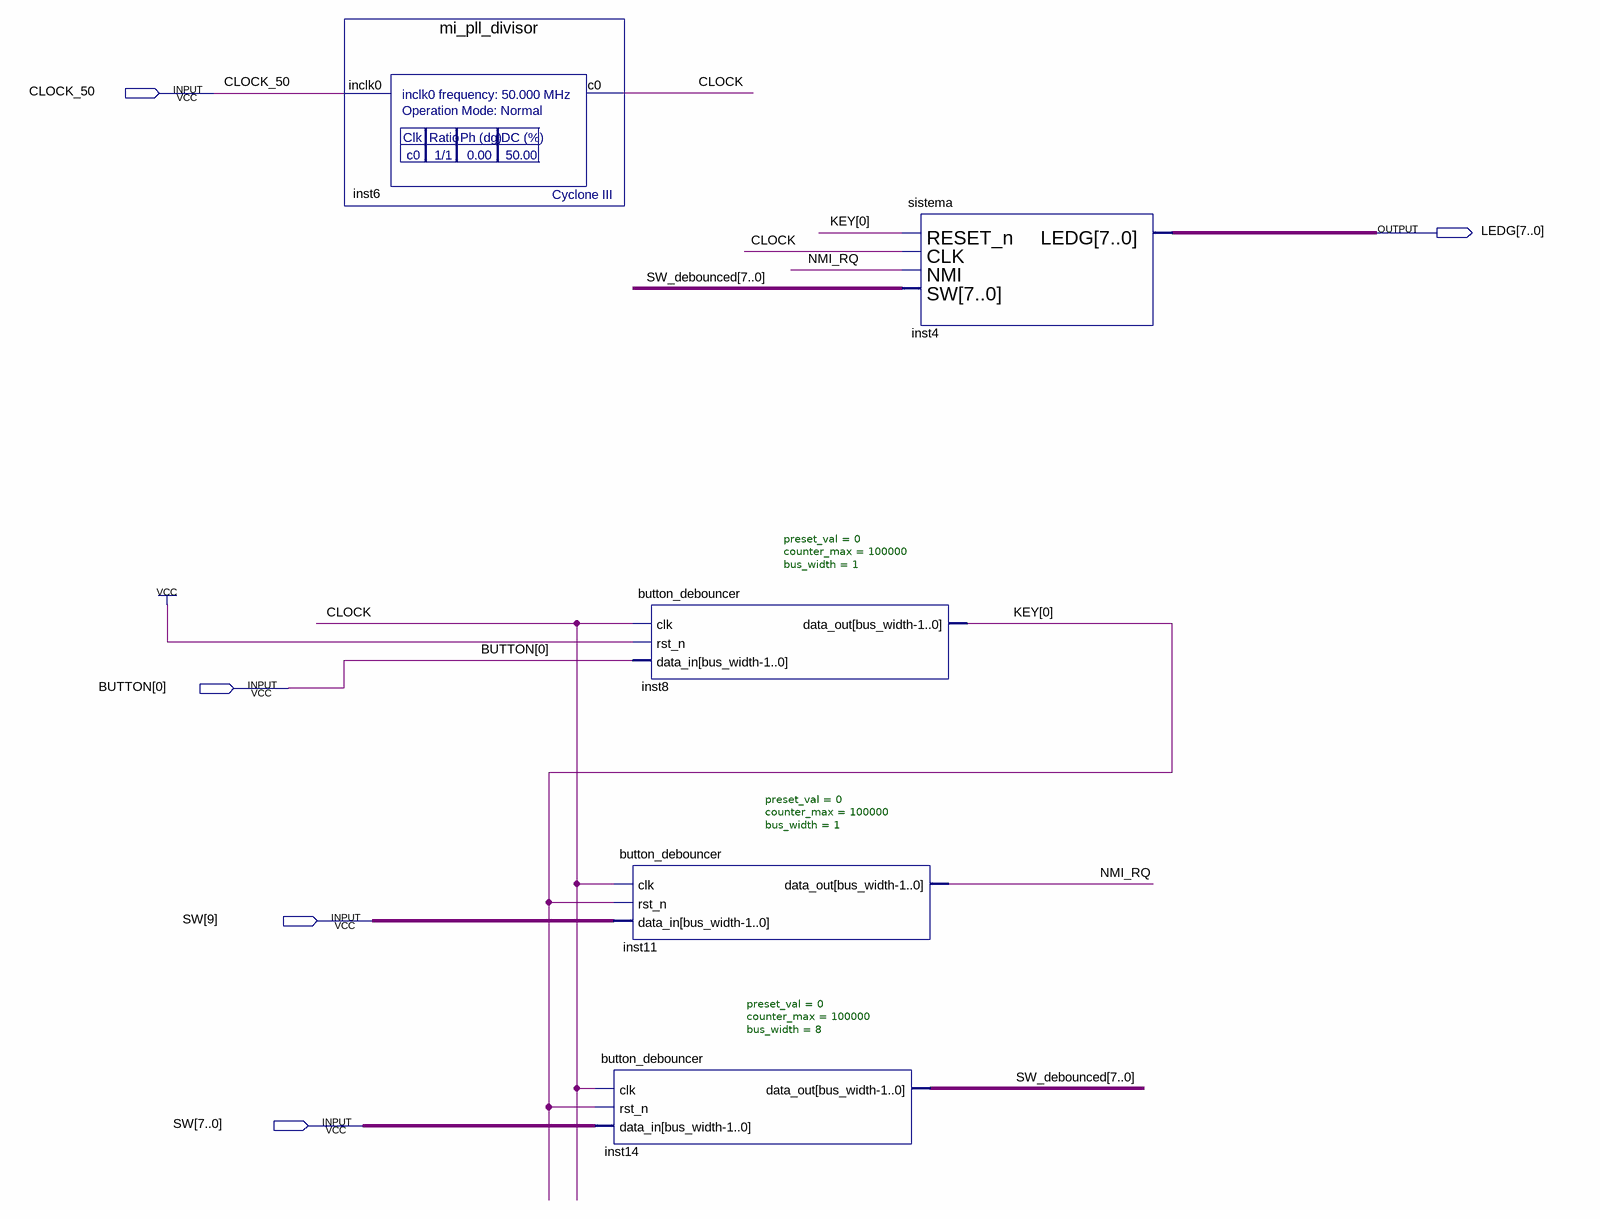
[diagram p0: schematic sheet]
// Quartus schematic sistema_top.bdf as structural Verilog: 5 symbols, 5 pins
module sistema_top (
  input  CLOCK_50,
  input  [0:0] BUTTON,
  input  [9:0] SW,
  output [7:0] LEDG
);

  wire CLOCK, NMI_RQ;
  wire [0:0] KEY;
  wire [7:0] SW_debounced;

  mi_pll_divisor inst6 (.inclk0(CLOCK_50), .c0(CLOCK));
  button_debouncer #(.preset_val(0), .counter_max(100000), .bus_width(8)) inst14 (
    .clk(CLOCK), .rst_n(KEY[0]), .data_in(SW[7:0]), .data_out(SW_debounced));
  button_debouncer #(.preset_val(0), .counter_max(100000), .bus_width(1)) inst8 (
    .clk(CLOCK), .rst_n(1'b1), .data_in(BUTTON[0]), .data_out(KEY[0]));
  button_debouncer #(.preset_val(0), .counter_max(100000), .bus_width(1)) inst11 (
    .clk(CLOCK), .rst_n(KEY[0]), .data_in(SW[9]), .data_out(NMI_RQ));
  sistema inst4 (.RESET_n(KEY[0]), .CLK(CLOCK), .NMI(NMI_RQ), .SW(SW_debounced), .LEDG(LEDG));
endmodule
